# EAGLE design ft231xs (EAGLE 7.5.0)
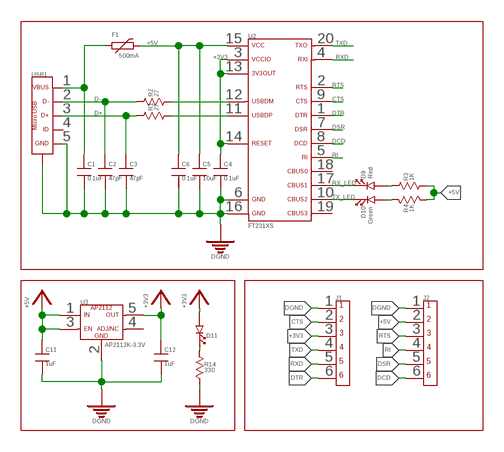
[diagram p0: schematic, sheet 1]

## Parts
C1  0.1uF  CAPACITOR_FIXED_0805  [0805]
C2  47pF  CAPACITOR_FIXED_0805  [0805]
C3  47pF  CAPACITOR_FIXED_0805  [0805]
C4  0.1uF  CAPACITOR_FIXED_0805  [0805]
C5  10uF  CAPACITOR_FIXED_0805  [0805]
C6  0.1uF  CAPACITOR_FIXED_0805  [0805]
C11  1uF  CAPACITOR_FIXED_0805  [0805]
C12  1uF  CAPACITOR_FIXED_0805  [0805]
D9  Red  LED-0805  [0805DIODE]
D10  Green  LED-0805  [0805DIODE]
D11  LED-0805  [0805DIODE]
F1  500mA  PTC_0805  [0805]
J1  6PIN_HEADER_PITCH2.54MM_TH  [6PIN_HEADER_PITCH2.54MM_TH]
J2  6PIN_HEADER_PITCH2.54MM_TH  [6PIN_HEADER_PITCH2.54MM_TH]
R1  27  RESISTOR_0805  [0805]
R2  27  RESISTOR_0805  [0805]
R3  1K  RESISTOR_0805  [0805]
R4  1K  RESISTOR_0805  [0805]
R14  330  RESISTOR_0805  [0805]
U2  FT231XS_SSOP20  [SSOP-20]
U3  AP2112K-3.3V  AP2112K_SOT-23-5  [SOT-23-5]
USB1  USB-2.0-MICRO_SMD_SMD  [MICRO-USB-B-SMD-SMD]

## Nets
+3V3: C4.1 C12.1 D11.2 J1.3 U2.3 U2.13 U2.14 U3.5
+5V: C5.1 C6.1 C11.1 F1.2 J2.2 R3.2 R4.2 U2.15 U3.1 U3.3
CTS: J1.2 U2.9
D+: C3.1 R1.1 USB1.3(D+)
D-: C2.1 R2.1 USB1.2(D-)
DCD: J2.6 U2.8
DGND: C1.2 C2.2 C3.2 C4.2 C5.2 C6.2 C11.2 C12.2 J1.1 J2.1 R14.2 U2.6 U2.16 U3.2 USB1.5(GND) USB1.S1(SHIELD) USB1.S2(SHIELD)
DSR: J2.5 U2.7
DTR: J1.6 U2.1
N$27: R2.2 U2.12
N$28: R1.2 U2.11
N$32: D9.2 R3.1
N$33: D10.2 R4.1
N$35: D11.1 R14.1
RI: J2.4 U2.5
RTS: J2.3 U2.2
RX_LED: D9.1 U2.17
RXD: J1.5 U2.4
TX_LED: D10.1 U2.10
TXD: J1.4 U2.20
VBUS: C1.1 F1.1 USB1.1(VBUS)
Unconnected: U2.18 U2.19 U3.4 USB1.4(ID)

## Library data of the parts
C1-C6 C11 C12 = Capacitors:CAPACITOR_FIXED
D9-D11 = LEDs:LED
F1 = Fuse:PTC
J1 J2 = Connectors:6PIN
R1-R4 R14 = Resistors:RESISTOR
U2 = FTDI:FT231XS
U3 = Power Supplies:AP2112K
USB1 = Connectors:USB-2.0-MICRO

## Board
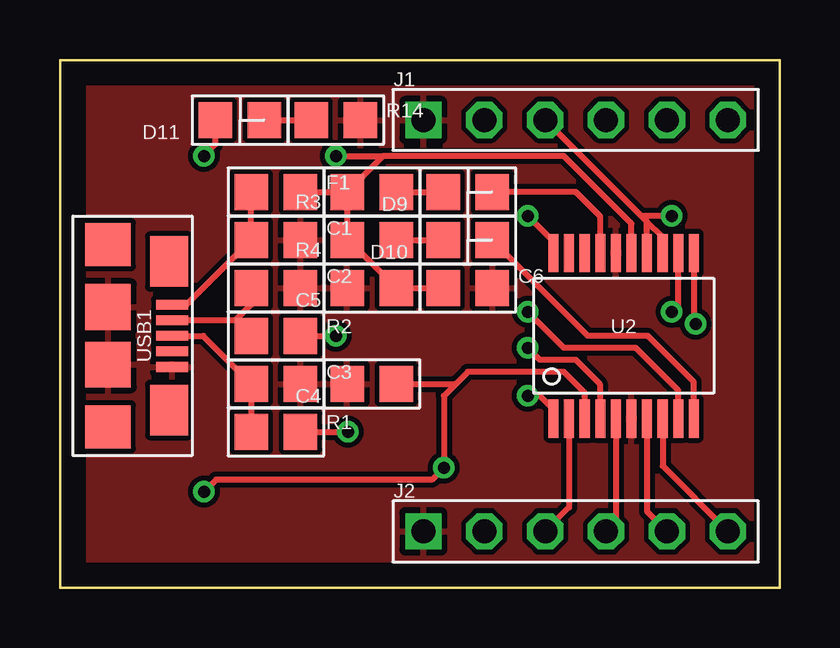
[diagram p1: board, top side]
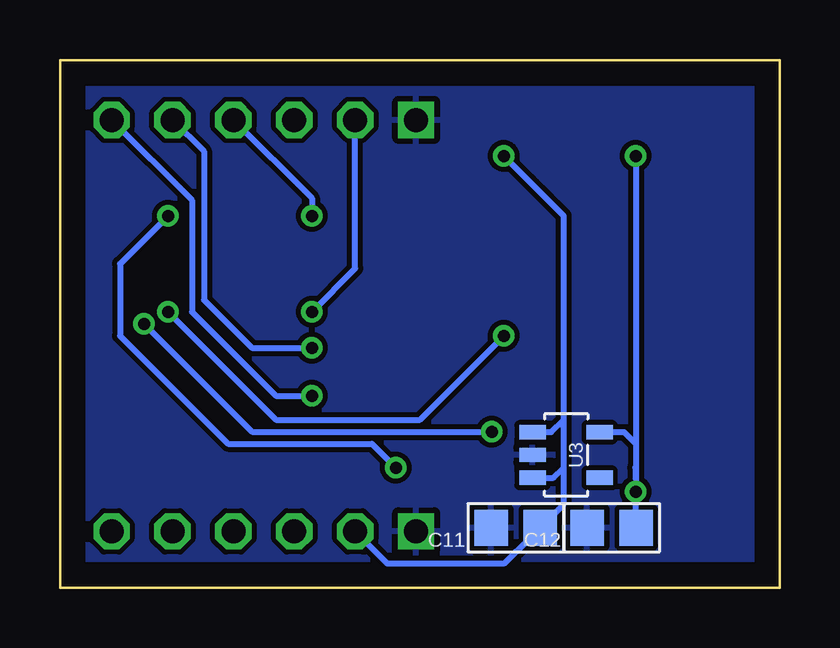
[diagram p2: board, bottom side, seen from below]

Size 30 x 22 mm. Coordinates in mm from the lower left corner, seen from the top.
Outline: 0,0 30,0 30,22 0,22 0,0
Copper layers (1*16): Top 0.035mm / dielectric 1.5mm / Bottom 0.035mm
Design rules "default": minimum track width 10mil, minimum drill 24mil, track to track 8mil, track to pad 8mil, pad to pad 8mil, via to via 8mil, smd to smd 8mil, copper to edge 40mil, drill to drill 8mil, minimum pad ring 10mil, minimum via ring 8mil, stop-mask expansion 4mil, vias tented up to drill 0mil, thermal gap 10mil

### Footprints (pad centres in the part's own frame; a part is rotated, then mirrored left to right if it is on the bottom)
0805 = smd 1.4 x 1.5: 1 -1.025,0; 2 1.025,0
0805DIODE = smd 1.4 x 1.5: 1 -1.025,0; 2 1.025,0
6PIN_HEADER_PITCH2.54MM_TH = drill 1 square: 1 -6.35,0 | drill 1 octagon: 2 -3.81,0; 3 -1.27,0; 4 1.27,0; 5 3.81,0; 6 6.35,0
SSOP-20 = smd 0.42 x 1.6: 1 -2.925,-3.45; 2 -2.275,-3.45; 3 -1.625,-3.45; 4 -0.975,-3.45; 5 -0.325,-3.45; 6 0.325,-3.45; 7 0.975,-3.45; 8 1.625,-3.45; 9 2.275,-3.45; 10 2.925,-3.45; 11 2.925,3.45; 12 2.275,3.45; 13 1.625,3.45; 14 0.975,3.45; 15 0.325,3.45; 16 -0.325,3.45; 17 -0.975,3.45; 18 -1.625,3.45; 19 -2.275,3.45; 20 -2.925,3.45
SOT-23-5 = smd 0.6 x 1.1: 1 -0.95,-1.4; 2 0,-1.4; 3 0.95,-1.4; 4 0.95,1.4; 5 -0.95,1.4
MICRO-USB-B-SMD-SMD = smd 0.4 x 1.35: 1 -1.3,2.675; 2 -0.65,2.675; 3 0,2.675; 4 0.65,2.675; 5 1.3,2.675 | smd 2.1 x 1.6: M1 -3.1,2.55; M2 3.1,2.55 | smd 1.8 x 1.9: M3 -3.8,0; M4 3.8,0 | smd 1.9 x 1.9: S1 -1.2,0; S2 1.2,0

### Placement (x,y rotation side)
C1  9,14.5 0 top
C2  9,12.5 0 top
C3  9,8.5 0 top
C4  13,8.5 180 top
C5  13,12.5 180 top
C6  17,12.5 0 top
C11  11,2.5 180 bottom
C12  7,2.5 180 bottom
D9  17,16.5 180 top
D10  17,14.5 180 top
D11  7.5,19.5 180 top
F1  9,16.5 0 top
J1  21.5,19.5 0 top
J2  21.5,2.34 0 top
R1  9,6.5 0 top
R2  9,10.5 0 top
R3  13,16.5 180 top
R4  13,14.5 180 top
R14  11.5,19.5 0 top
U2  23.5,10.5 0 top
U3  8.9,5.53 270 bottom
USB1  2,10.5 270 top

### Tracks (layer width: path | path; a pad name or v marks a point on that pad's centre or on a via)
+3V3  (via drill 0.5)
  Top 0.254: U2.14 24.48,15.26 | 24.48,15.26 24.23,15.5 | 24.23,15.5 J1.3 | D11.2 6.47,18.48 v6,18 | U2.3 21.88,8.12 21,9 17,9 16.5,8.5 | U2.13 25.12,14.61 24.48,15.26 | 16.5,8.5 16,8 v16,5 15.5,4.5 6.5,4.5 v6,4 | C4.1 16.5,8.5 | v25.5,15.5 24.23,15.5
  Bottom 0.254: v6,18 6,6 | 6,6 v6,4 | C12.1 6,2.52 v6,4 | 6.02,5 v6,4 | U3.5 6.48,6.48 6,6 | v25.5,15.5 27.5,13.5 27.5,10.5 23,6 17,6 v16,5
+5V  (via drill 0.5)
  Top 0.254: F1.2 R3.2 | R3.2 R4.2 12.03,14.5 C5.1 C6.1 | U2.15 23.82,15.18 21,18 13.47,18 | 13.47,18 R3.2 | v11.5,18 13.47,18
  Bottom 0.254: J2.2 16.35,1 11.5,1 11,1.5 10.97,1.5 C11.1 9,3.48 9,5 | 9,5 9,7 | 9,7 9,15.5 v11.5,18 | U3.3 9.42,4.58 9,5 | U3.1 9.52,6.48 9,7
CTS  (via drill 0.5)
  Top 0.254: U2.9 25.77,8.22 24,10 21,10 v19.5,11.5
  Bottom 0.254: v19.5,11.5 17.69,13.31 J1.2
D+
  Top 0.254: R1.1 C3.1 5.97,10.5 USB1.3
D-
  Top 0.254: USB1.2 7.33,11.15 | 7.33,11.15 R2.1 | C2.1 7.97,11.8 7.33,11.15
DCD
  Top 0.254: U2.8 25.12,5.07 J2.6
DGND
  pour Top: 1,21 29,21 29,1 1,1
  pour Bottom: 1,21 29,21 29,1 1,1
DSR
  Top 0.254: U2.7 24.48,3.17 J2.5
DTR  (via drill 0.5)
  Top 0.254: v19.5,8 20,8 20.57,7.42 U2.1
  Bottom 0.254: v19.5,8 21,8 24.5,11.5 24.5,16.15 J1.6
N$27  (via drill 0.5)
  Top 0.254: R2.2 v11.5,10.5 | v25.5,11.5 25.77,11.78 U2.12
  Bottom 0.254: v25.5,11.5 21,7 15,7 v11.5,10.5
N$28  (via drill 0.5)
  Top 0.254: R1.2 v12,6.5 | U2.11 26.43,11.07 v26.5,11
  Bottom 0.254: v26.5,11 22,6.5 v12,6.5
N$32
  Top 0.254: R3.1 D9.2
N$33
  Top 0.254: R4.1 D10.2
N$35
  Top 0.254: D11.1 R14.1
RI
  Top 0.254: U2.5 23.18,2.75 J2.4
RTS
  Top 0.254: U2.2 21.23,3.33 J2.3
RX_LED
  Top 0.254: U2.17 22.52,15.47 21.5,16.5 D9.1
RXD  (via drill 0.5)
  Top 0.254: U2.4 22.5,7.08 22.5,8.5 21.5,9.5 20,9.5 v19.5,10
  Bottom 0.254: J1.5 24,18.19 24,12 22,10 v19.5,10
TX_LED
  Top 0.254: D10.1 18.02,14.47 22,10.5 24.5,10.5 26.43,8.57 U2.10
TXD  (via drill 0.5)
  Top 0.254: U2.20 20.57,14.43 v19.5,15.5
  Bottom 0.254: J1.4 19.5,16.23 v19.5,15.5
VBUS
  Top 0.254: F1.1 C1.1 5.28,11.8 USB1.1